# Altium schematic sheet POEActiveTransformer.SchDoc
size A
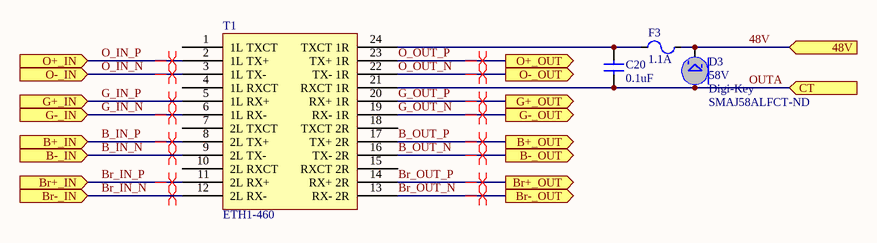
[diagram p0: POEActiveTransformer.SchDoc]

## Parts
C20  value 0.1uF  [CAPC0603]  (hidden comment: Cap)
D3  value 58V  Supplier 1: Digi-Key  Supplier Part Number 1: SMAJ58ALFCT-ND  [SMASeries]  (hidden comment: Zener)
F3  value 1.1A  [PTC7451X11N]  (hidden comment: PTC Fuse)
T1  ETH1-460  [ETH1-460]

## Ports
48V (in), B+_IN (in), B+_OUT (out), B-_IN (in), B-_OUT (out), Br+_IN (in), Br+_OUT (out), Br-_IN (in), Br-_OUT (out), CT (in), G+_IN (in), G+_OUT (out), G-_IN (in), G-_OUT (out), O+_IN (in), O+_OUT (out), O-_IN (in), O-_OUT (out)

## Nets
48V: D3.C F3.2(B) ; port 48V
B_IN_N: T1.9(2L_TX-) ; port B-_IN
B_IN_P: T1.8(2L_TX+) ; port B+_IN
B_OUT_N: T1.16(TX-_2R) ; port B-_OUT
B_OUT_P: T1.17(TX+_2R) ; port B+_OUT
Br_IN_N: T1.12(2L_RX-) ; port Br-_IN
Br_IN_P: T1.11(2L_RX+) ; port Br+_IN
Br_OUT_N: T1.13(RX-_2R) ; port Br-_OUT
Br_OUT_P: T1.14(RX+_2R) ; port Br+_OUT
G_IN_N: T1.6(1L_RX-) ; port G-_IN
G_IN_P: T1.5(1L_RX+) ; port G+_IN
G_OUT_N: T1.19(RX-_1R) ; port G-_OUT
G_OUT_P: T1.20(RX+_1R) ; port G+_OUT
O_IN_N: T1.3(1L_TX-) ; port O-_IN
O_IN_P: T1.2(1L_TX+) ; port O+_IN
O_OUT_N: T1.22(TX-_1R) ; port O-_OUT
O_OUT_P: T1.23(TX+_1R) ; port O+_OUT
OUTA: C20.2(B) D3.A T1.21(RXCT_1R) ; port CT
NetC20_1: C20.1(A) F3.1(A) T1.24(TXCT_1R)

Not connected (* = marked no-connect by the designer): T1 1(1L_TXCT) 4(1L_RXCT) 7(2L_TXCT) 10(2L_RXCT) 15(RXCT_2R) 18(TXCT_2R)

## Layout directives
differential pair: B_IN_N, B_IN_P, B_OUT_N, B_OUT_P, Br_IN_N, Br_IN_P, Br_OUT_N, Br_OUT_P, G_IN_N, G_IN_P, G_OUT_N, G_OUT_P, O_IN_N, O_IN_P, O_OUT_N, O_OUT_P

## Library data of the parts
D3 = Zener: Zener Diode
F3 = PTC_Fuse: Supplier 1: Digi-Key; Supplier Part Number 1: 507-1744-1-ND
T1 = ETH1-460: "PoE Plus" Transformers Audio & Signal ETH1 60W 4pairs PoE+ Magnetic Module; Supplier 1: *; Supplier Part Number 1: *
C20 = Cap: Supplier 1: Digi-Key; Supplier Part Number 1: 1276-6807-1-ND